# EAGLE design atmega328_core (EAGLE 6.4)
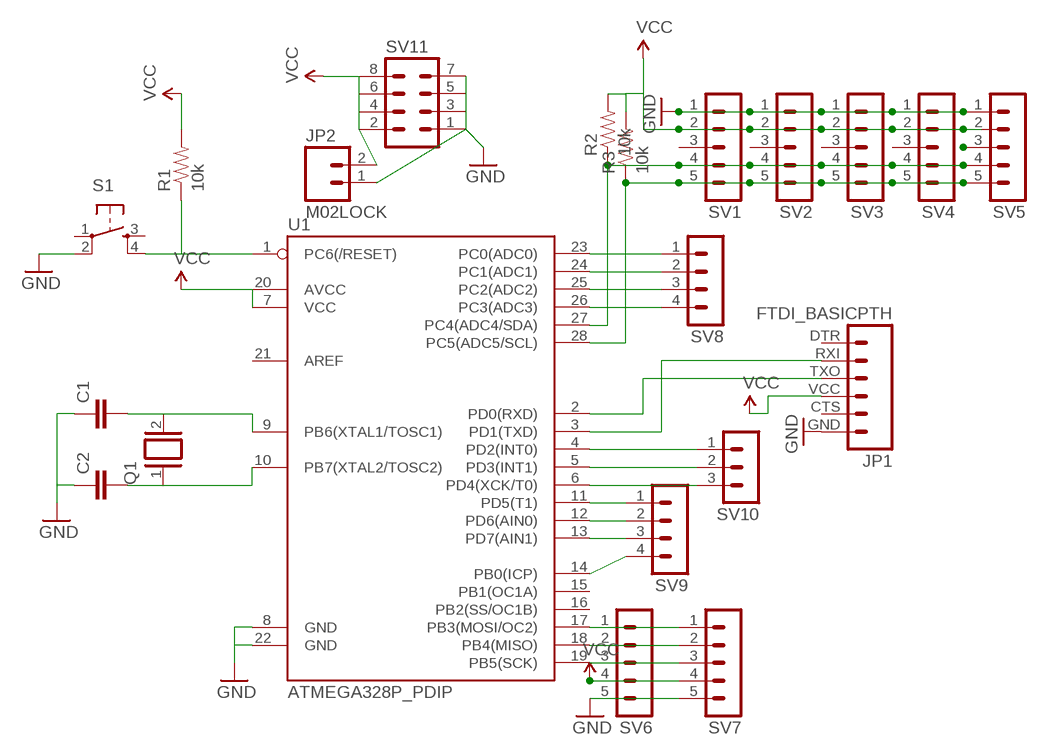
[diagram p0: schematic, sheet 1]

## Parts
C1  CAPEZ  [CAP-PTH-SMALLEZ]
C2  CAPEZ  [CAP-PTH-SMALLEZ]
JP1  FTDI_BASICPTH  [FTDI_BASIC]
JP2  M02LOCK  [1X02_LOCK]
Q1  XTAL/S  [QS]
R1  10k  RESISTORKIT  [AXIAL-0.3-KIT]
R2  10k  RESISTORKIT  [AXIAL-0.3-KIT]
R3  10k  RESISTORKIT  [AXIAL-0.3-KIT]
S1  TAC_SWITCHPTH  [TACTILE-PTH]
SV1  MA05-1  [MA05-1]
SV2  MA05-1  [MA05-1]
SV3  MA05-1  [MA05-1]
SV4  MA05-1  [MA05-1]
SV5  MA05-1  [MA05-1]
SV6  MA05-1  [MA05-1]
SV7  MA05-1  [MA05-1]
SV8  MA04-1  [MA04-1]
SV9  MA04-1  [MA04-1]
SV10  MA03-1  [MA03-1]
SV11  MA04-2  [MA04-2]
U1  ATMEGA328P_PDIP  [DIL28-3]

## Nets
GND: C1.1 C2.1 JP1.GND JP2.1 S1.2 SV1.1 SV2.1 SV3.1 SV4.1 SV5.1 SV6.5 SV7.5 SV11.1 SV11.3 SV11.5 SV11.7 U1.8(GND) U1.22(GND)
N$1: R1.P$1 S1.4 U1.1(PC6(/RESET))
N$2: C1.2 Q1.2 U1.9(PB6(XTAL1/TOSC1))
N$3: C2.2 Q1.1 U1.10(PB7(XTAL2/TOSC2))
N$4: R2.P$1 SV1.4 SV2.4 SV3.4 SV4.4 SV5.4 U1.27(PC4(ADC4/SDA))
N$5: R3.P$1 SV1.5 SV2.5 SV3.5 SV4.5 SV5.5 U1.28(PC5(ADC5/SCL))
N$6: SV5.3
N$7: SV6.1 SV7.1 U1.17(PB3(MOSI/OC2))
N$8: SV6.2 SV7.2 U1.18(PB4(MISO))
N$9: SV6.3 SV7.3 U1.19(PB5(SCK))
N$12: SV8.1 U1.23(PC0(ADC0))
N$13: SV8.2 U1.24(PC1(ADC1))
N$14: SV8.3 U1.25(PC2(ADC2))
N$15: SV8.4 U1.26(PC3(ADC3))
N$16: SV9.1 U1.11(PD5(T1))
N$17: SV9.2 U1.12(PD6(AIN0))
N$18: SV9.3 U1.13(PD7(AIN1))
N$19: SV9.4 U1.14(PB0(ICP))
N$20: SV10.1 U1.4(PD2(INT0))
N$21: SV10.2 U1.5(PD3(INT1))
N$22: SV10.3 U1.6(PD4(XCK/T0))
RX$0: JP1.TXO U1.2(PD0(RXD))
TX$0: JP1.RXI U1.3(PD1(TXD))
VCC: JP1.VCC JP2.2 R1.P$2 R2.P$2 R3.P$2 SV1.2 SV2.2 SV3.2 SV4.2 SV5.2 SV6.4 SV7.4 SV11.2 SV11.4 SV11.6 SV11.8 U1.7(VCC) U1.20(AVCC)
Unconnected: JP1.CTS JP1.DTR S1.1 S1.3 SV1.3 SV2.3 SV3.3 SV4.3 U1.15(PB1(OC1A)) U1.16(PB2(SS/OC1B)) U1.21(AREF)

## Library data of the parts
C1 C2 = SparkFun-Passives:CAP: Capacitor Standard 0603 ceramic capacitor, and 0.1" leaded capacitor.
JP1 = SparkFun-Connectors:FTDI_BASIC: FTDI Basic header with labels
JP2 = SparkFun-Connectors:M02: Standard 2-pin 0.1" header. Use with - straight break away headers ( PRT-00116) - right angle break away headers (PRT-00553) - swiss pins (PRT-00743) - machine pins (PRT-00117) - female headers (PRT-00115) Molex polarized connector foot print use with: PRT-08233 with associated crimp pins and housings. 2.54_SCREWTERM for use with PRT-10571. 3.5mm Screw Terminal footprints for PRT-08084 5mm Screw Terminal footprints for use with PRT-08433
Q1 = special:XTAL/S: CRYSTAL
R1-R3 = SparkFun-Passives:RESISTOR: Resistor Basic schematic elements and footprints for 0603, 1206, and PTH resistors.
S1 = SparkFun-Electromechanical:TAC_SWITCH: Momentary Switch Button commonly used for reset or general input. Spark Fun Electronics SKU : COM-00097 SMT- SWCH-08247
SV1-SV7 = con-lstb:MA05-1: PIN HEADER; OC_FARNELL: unknown; OC_NEWARK: unknown
SV8 SV9 = con-lstb:MA04-1: PIN HEADER; OC_FARNELL: unknown; OC_NEWARK: unknown
SV10 = con-lstb:MA03-1: PIN HEADER; OC_FARNELL: unknown; OC_NEWARK: unknown
SV11 = con-lstb:MA04-2: PIN HEADER; OC_FARNELL: unknown; OC_NEWARK: unknown
U1 = SparkFun-DigitalIC:ATMEGA328P_PDIP: uC used in the Arduino 32kb flash, 1k EEPROM, 2k SRAM This is the through-hole version of this chip.

## Board
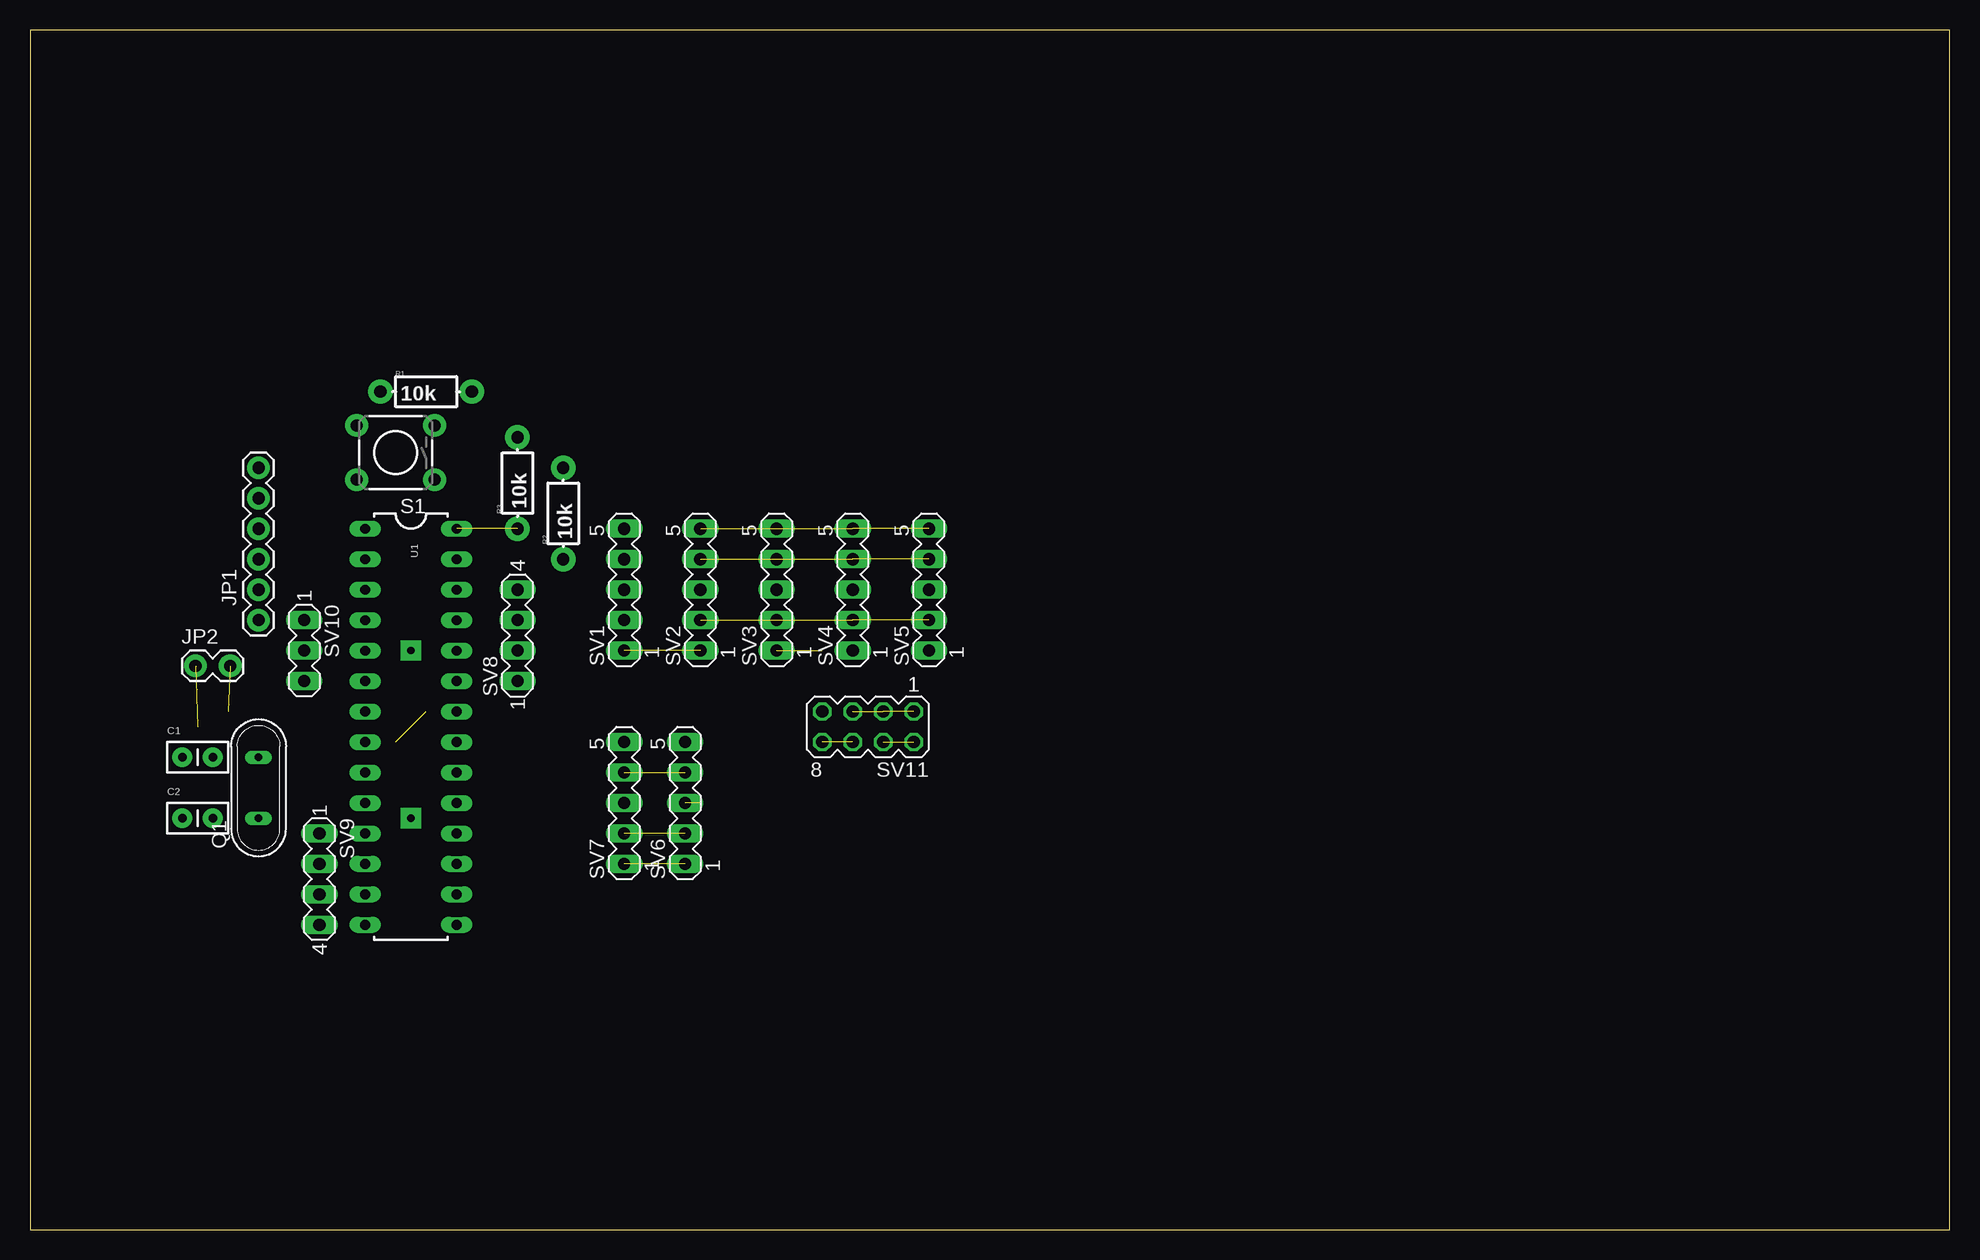
[diagram p1: board, top side]
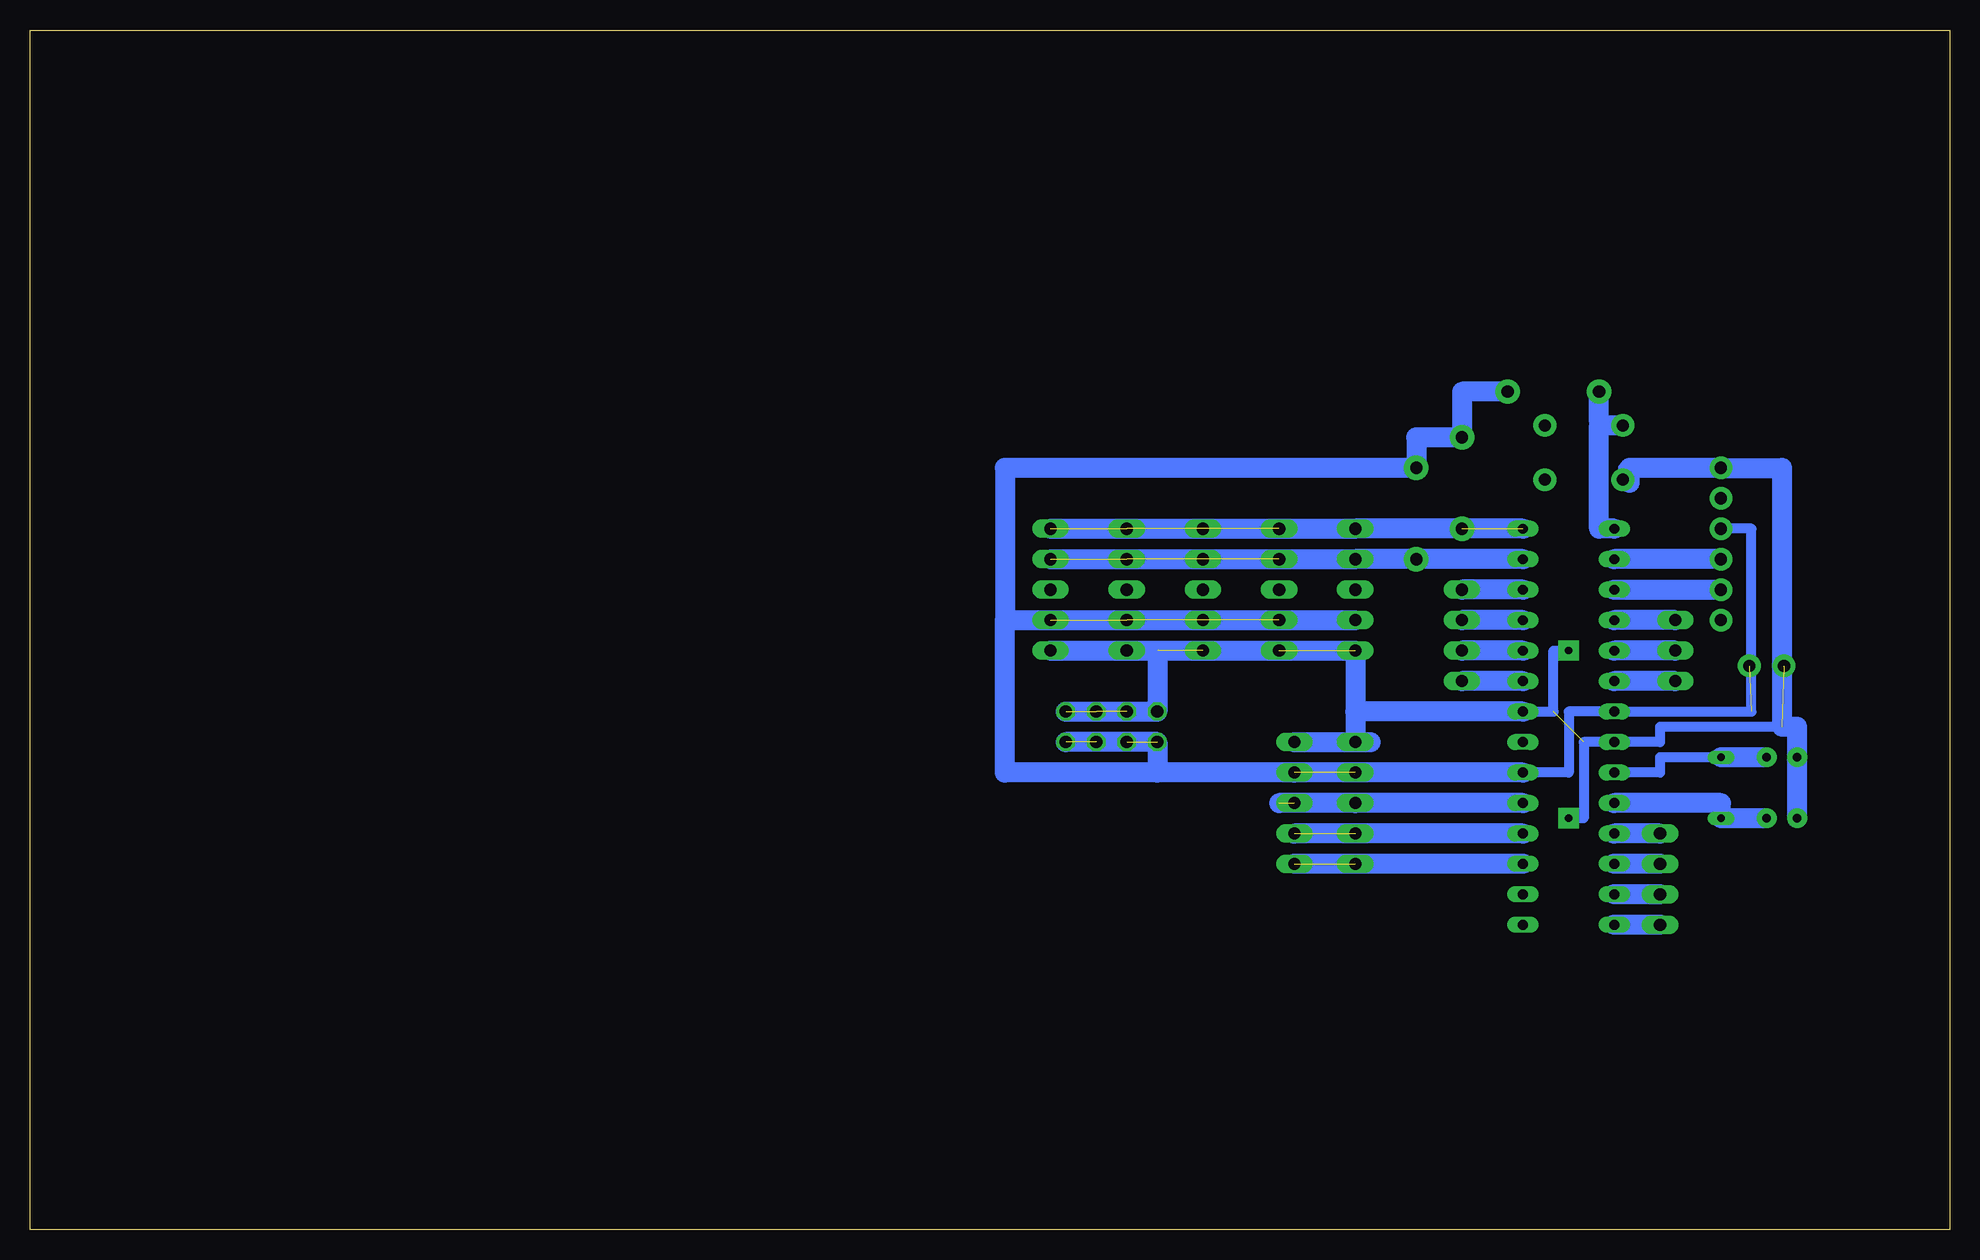
[diagram p2: board, bottom side, seen from below]

Size 160 x 100 mm. Coordinates in mm from the lower left corner, seen from the top.
Outline: 0,0 160,0 160,100 0,100 0,0
Copper layers (1*16): Top 0.035mm / dielectric 1.5mm / Bottom 0.035mm
Design rules "default": minimum track width 10mil, minimum drill 24mil, track to track 8mil, track to pad 8mil, pad to pad 8mil, via to via 8mil, smd to smd 8mil, copper to edge 40mil, drill to drill 8mil, minimum pad ring 10mil, minimum via ring 8mil, stop-mask expansion 4mil, vias tented up to drill 0mil, thermal gap 10mil

### Footprints (pad centres in the part's own frame; a part is rotated, then mirrored left to right if it is on the bottom)
CAP-PTH-SMALLEZ = drill 0.7 pad 1.651: 1 0,0; 2 2.54,0
FTDI_BASIC = drill 1.016 pad 1.88: CTS 10.16,0; DTR 0,0; GND 12.7,0; RXI 2.54,0; TXO 5.08,0; VCC 7.62,0
1X02_LOCK = drill 1.016 pad 1.88: 1 -0.178,0; 2 2.718,0
QS = drill 0.61 long: 1 -2.54,0; 2 2.54,0
AXIAL-0.3-KIT = drill 1.016 pad 2.032: P$1 -3.81,0; P$2 3.81,0
TACTILE-PTH = drill 1.016 pad 1.88: 1 -3.251,2.261; 2 3.251,2.261; 3 -3.251,-2.261; 4 3.251,-2.261
MA05-1 = drill 1.016 long: 1 -5.08,0; 2 -2.54,0; 3 0,0; 4 2.54,0; 5 5.08,0
MA04-1 = drill 1.016 long: 1 -3.81,0; 2 -1.27,0; 3 1.27,0; 4 3.81,0
MA03-1 = drill 1.016 long: 1 -2.54,0; 2 0,0; 3 2.54,0
MA04-2 = drill 1.016 octagon: 1 -3.81,-1.27; 2 -3.81,1.27; 3 -1.27,-1.27; 4 -1.27,1.27; 5 1.27,-1.27; 6 1.27,1.27; 7 3.81,-1.27; 8 3.81,1.27
DIL28-3 = drill 0.813 long: 1 -16.51,-3.81; 2 -13.97,-3.81; 3 -11.43,-3.81; 4 -8.89,-3.81; 5 -6.35,-3.81; 6 -3.81,-3.81; 7 -1.27,-3.81; 8 1.27,-3.81; 9 3.81,-3.81; 10 6.35,-3.81; 11 8.89,-3.81; 12 11.43,-3.81; 13 13.97,-3.81; 14 16.51,-3.81; 15 16.51,3.81; 16 13.97,3.81; 17 11.43,3.81; 18 8.89,3.81; 19 6.35,3.81; 20 3.81,3.81; 21 1.27,3.81; 22 -1.27,3.81; 23 -3.81,3.81; 24 -6.35,3.81; 25 -8.89,3.81; 26 -11.43,3.81; 27 -13.97,3.81; 28 -16.51,3.81

### Placement (x,y rotation side)
C1  12.7,39.37 0 top
C2  12.7,34.29 0 top
JP1  19.05,50.8 90 top
JP2  13.97,46.99 0 top
Q1  19.05,36.83 90 top
R1  33.02,69.85 0 top
R2  44.45,59.69 90 top
R3  40.64,62.23 90 top
S1  30.48,64.77 180 top
SV1  49.53,53.34 90 top
SV2  55.88,53.34 90 top
SV3  62.23,53.34 90 top
SV4  68.58,53.34 90 top
SV5  74.93,53.34 90 top
SV6  54.61,35.56 90 top
SV7  49.53,35.56 90 top
SV8  40.64,49.53 90 top
SV9  24.13,29.21 270 top
SV10  22.86,48.26 270 top
SV11  69.85,41.91 180 top
U1  31.75,41.91 270 top

### Tracks (layer width: path | path; a pad name or v marks a point on that pad's centre or on a via)
GND  (6 unrouted)
  Bottom 0.813: 13.97,41.91 24.13,41.91 24.13,40.64 U1.8 30.48,40.64 30.48,34.29 31.75,34.29 | S1.2 27.23,63.5 26.67,63.5 26.67,62.51 | U1.22 33.02,43.18 33.02,48.26 31.75,48.26 | SV4.1 66.04,48.26
  Bottom 1.676: C2.1 C1.1 12.7,41.91 13.97,41.91 13.97,63.5 JP1.GND 26.67,63.5 | SV6.5 SV7.5 | SV7.5 48.26,40.64 | SV5.1 SV4.1 SV1.1 49.53,43.18 | U1.22 49.53,43.18 | 49.53,43.18 SV7.5 | S1.2 26.67,62.51 26.67,62.23 | 66.04,48.26 SV11.7 SV11.1
N$1
  Bottom 0.813: 29.21,67.03 29.21,67.31
  Bottom 1.676: U1.1 29.21,58.42 29.21,67.03 S1.4 | 29.21,67.31 R1.P$1
N$2
  Bottom 0.813: Q1.2 24.13,39.37 24.13,38.1 U1.9
  Bottom 1.676: C1.2 Q1.2
N$3
  Bottom 1.676: U1.10 19.05,35.56 Q1.1 C2.2
N$4  (3 unrouted)
  Bottom 1.676: SV5.4 SV1.4 R2.P$1 U1.27
N$5  (4 unrouted)
  Bottom 0.813: SV1.5 48.26,58.42
  Bottom 1.676: SV5.5 SV1.5 U1.28
N$7  (1 unrouted)
  Bottom 1.676: U1.17 SV6.1
N$8  (1 unrouted)
  Bottom 1.676: U1.18 SV6.2
N$9  (1 unrouted)
  Bottom 1.676: U1.19 SV7.3 55.88,35.56
N$10  (via drill 0.6 pad 1.68)
  other vias: 31.75,34.29
N$11  (via drill 0.6 pad 1.68)
  other vias: 31.75,48.26
N$12
  Bottom 1.676: U1.23 SV8.1
N$13
  Bottom 1.676: U1.24 SV8.2
N$14
  Bottom 1.676: U1.25 SV8.3
N$15
  Bottom 1.676: U1.26 SV8.4
N$16
  Bottom 1.676: SV9.1 U1.11
N$17
  Bottom 1.676: SV9.2 U1.12
N$18
  Bottom 1.676: SV9.3 U1.13
N$19
  Bottom 1.676: SV9.4 U1.14
N$20
  Bottom 1.676: SV10.1 U1.4
N$21
  Bottom 1.676: SV10.2 U1.5
N$22
  Bottom 1.676: SV10.3 U1.6
RX$0
  Bottom 1.676: JP1.TXO U1.2
TX$0
  Bottom 1.676: U1.3 JP1.RXI
VCC  (7 unrouted)
  Bottom 0.813: JP1.VCC 16.51,58.42 16.51,43.18 U1.7 31.75,43.18 31.75,38.1 U1.20
  Bottom 1.676: U1.20 SV6.4 66.04,38.1 | SV1.2 SV5.2 78.74,50.8 | R1.P$2 40.64,69.85 R3.P$2 44.45,66.04 R2.P$2 78.74,63.5 78.74,50.8 | 66.04,38.1 78.74,38.1 78.74,50.8 | 66.04,38.1 SV11.8 SV11.2